# Altium schematic sheet Sheet1.SCHDOC
size 420 x 297 mm; SheetNumber: 1; SheetTotal: 1; DocumentName: Sheet1.SCHDOC
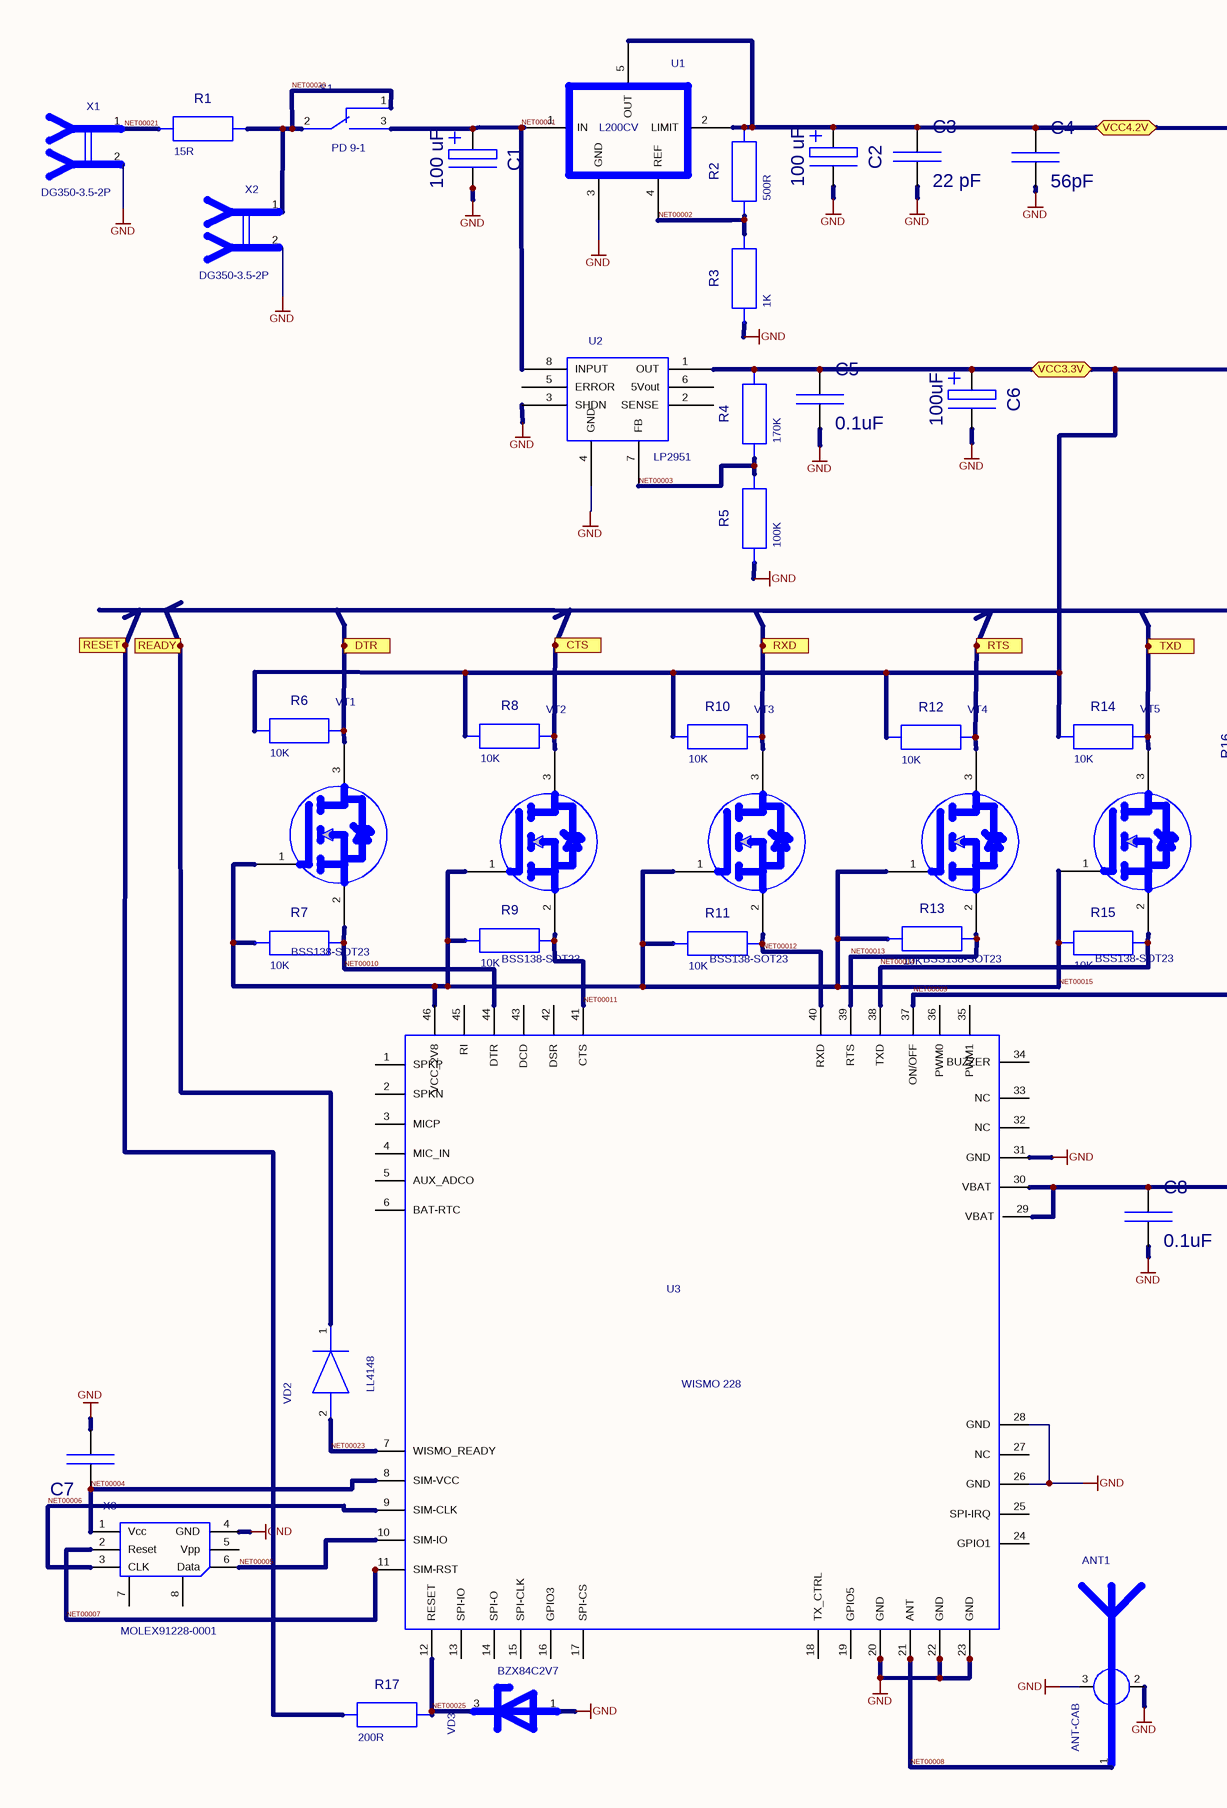
[diagram p0: Sheet1.SCHDOC, left]
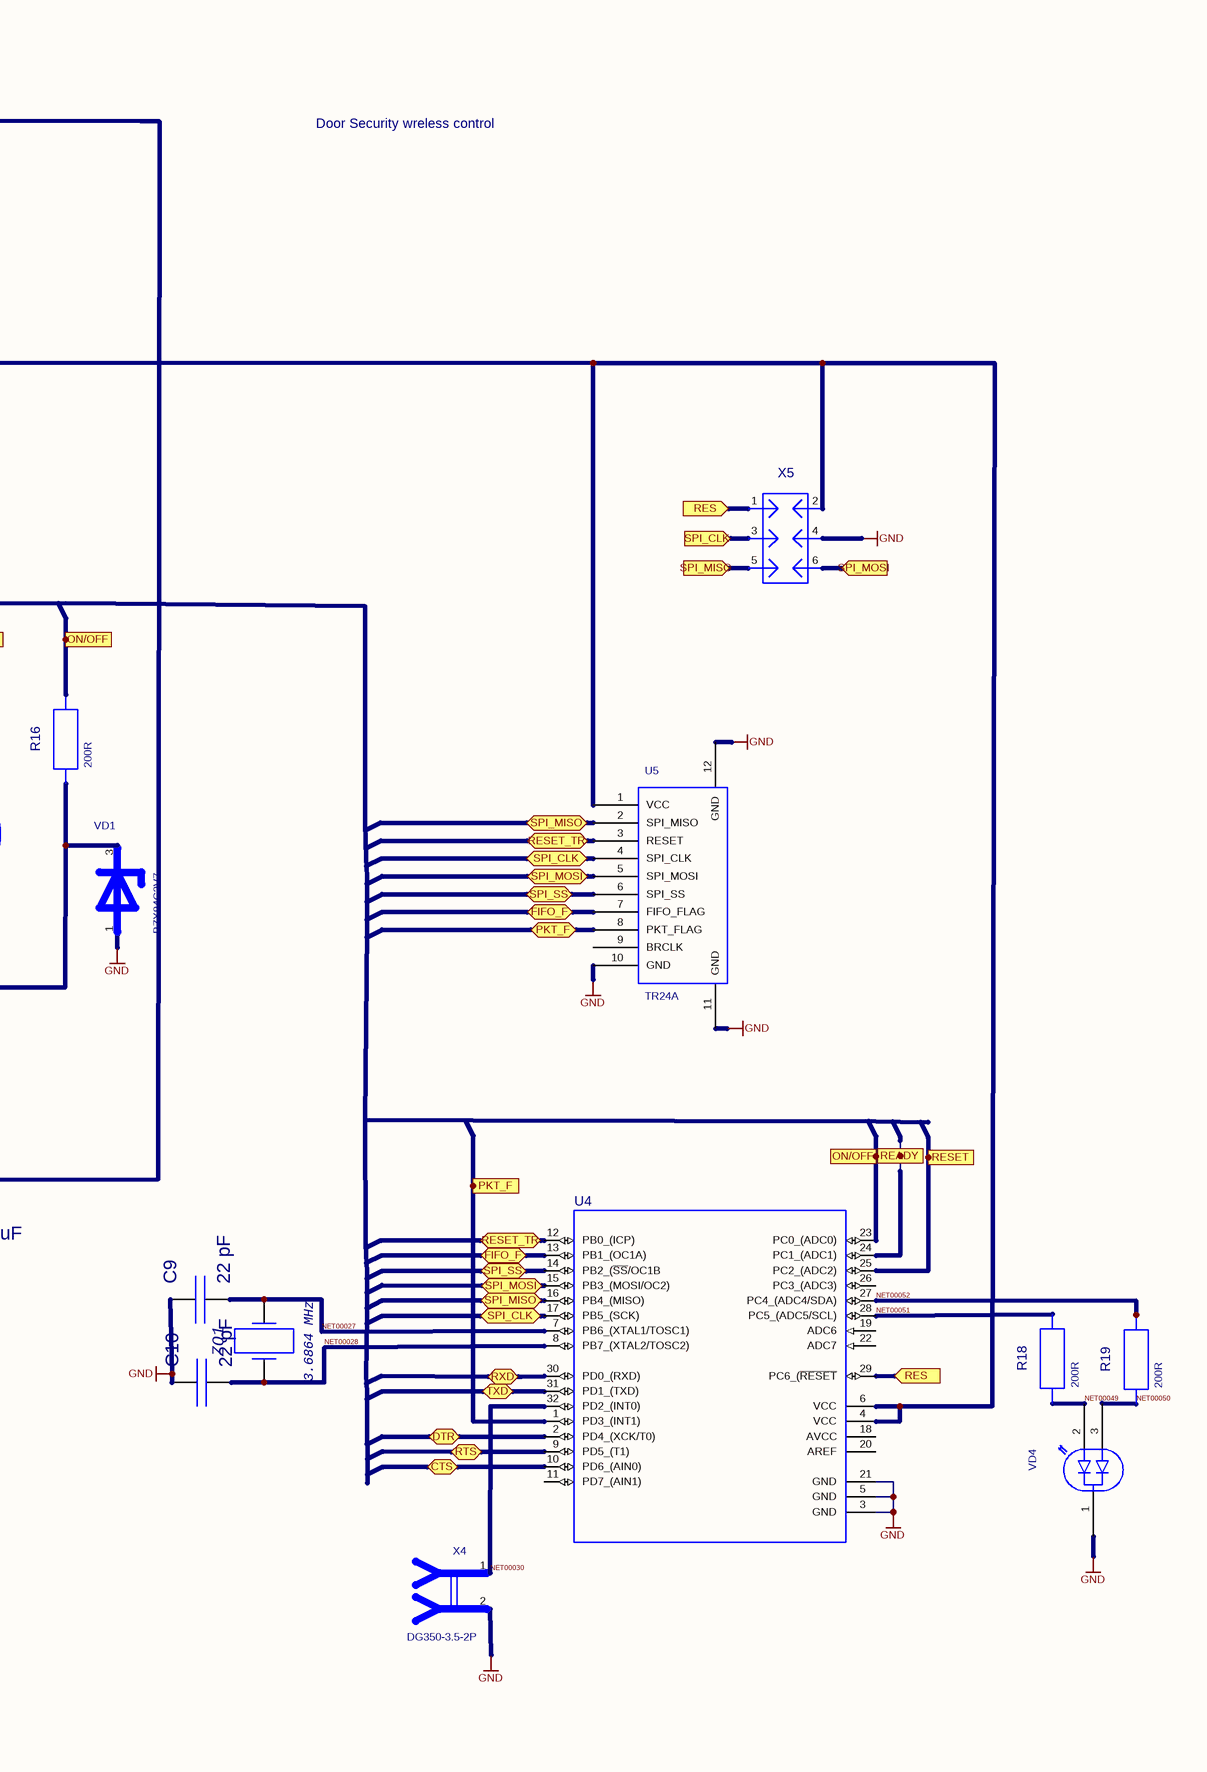
[diagram p1: Sheet1.SCHDOC, right]

## Parts
ANT1  ANT-CAB  [ANT-CAB_ANT-CAB()]
C1  value 100 uF  [KONDENS-E6.5_KONDENS-E6.5MM()]  (hidden comment: KONDENS-E6.5MM)
C2  value 100 uF  [KONDENS-E6.5_KONDENS-E6.5MM()]  (hidden comment: KONDENS-E6.5MM)
C3  value 22 pF  [C0805_KONDENS_SMD()]  (hidden comment: KONDENS_SMD)
C4  value 56pF  [C0805_KONDENS_SMD()]  (hidden comment: KONDENS_SMD)
C5  value 0.1uF  [C0805_KONDENS_SMD()]  (hidden comment: KONDENS_SMD)
C6  value 100uF  [KONDENS-E6.5_KONDENS-E6.5MM()]  (hidden comment: KONDENS-E6.5MM)
C7  KONDENS_SMD  [C0805_KONDENS_SMD()]  (value not drawn)
C8  value 0.1uF  [C0805_KONDENS_SMD()]  (hidden comment: KONDENS_SMD)
C9  value 22 pF  [C0805_KONDENS_SMD()]  (hidden comment: KONDENS_SMD)
C10  value 22 pF  [C0805_KONDENS_SMD()]  (hidden comment: KONDENS_SMD)
R1  value 15R  [R2W_R2W()]  (hidden comment: R2W)
R2  value 500R  [RR0805_RR0805()]  (hidden comment: RR0805)
R3  value 1K  [RR0805_RR0805()]  (hidden comment: RR0805)
R4  value 170K  [RR0805_RR0805()]  (hidden comment: RR0805)
R5  value 100K  [RR0805_RR0805()]  (hidden comment: RR0805)
R6  value 10K  [RR0805_RR0805()]  (hidden comment: RR0805)
R7  value 10K  [RR0805_RR0805()]  (hidden comment: RR0805)
R8  value 10K  [RR0805_RR0805()]  (hidden comment: RR0805)
R9  value 10K  [RR0805_RR0805()]  (hidden comment: RR0805)
R10  value 10K  [RR0805_RR0805()]  (hidden comment: RR0805)
R11  value 10K  [RR0805_RR0805()]  (hidden comment: RR0805)
R12  value 10K  [RR0805_RR0805()]  (hidden comment: RR0805)
R13  value 10K  [RR0805_RR0805()]  (hidden comment: RR0805)
R14  value 10K  [RR0805_RR0805()]  (hidden comment: RR0805)
R15  value 10K  [RR0805_RR0805()]  (hidden comment: RR0805)
R16  value 200R  [RR0805_RR0805()]  (hidden comment: RR0805)
R17  value 200R  [RR0805_RR0805()]  (hidden comment: RR0805)
R18  value 200R  [RR0805_RR0805()]  (hidden comment: RR0805)
R19  value 200R  [RR0805_RR0805()]  (hidden comment: RR0805)
S1  PD 9-1  [PD 9-1_PD 9-1()]
U1  L200CV  [L200CV_L200CV()]
U2  LP2951  [SOIC-8_LP2951()]
U3  WISMO 228  [WISMO_WISMO 228()]
U4  ATMEGA8L-8AI  [32A_ATMEGA8L-8AI()]  (value not drawn)
U5  TR24A  [TR24A_TR24A()]
VD1  BZX84C2V7  [SOT23_BZX84C2V7()]
VD2  LL4148  [MINI MELF_LL4148()]
VD3  BZX84C2V7  [SOT23_BZX84C2V7()]
VD4  LIGHTDIODE2  [LIGHTDIODE2_LIGHTDIODE2()]  (value not drawn)
VT1  BSS138-SOT23  [SOT23_BSS138-SOT23()]
VT2  BSS138-SOT23  [SOT23_BSS138-SOT23()]
VT3  BSS138-SOT23  [SOT23_BSS138-SOT23()]
VT4  BSS138-SOT23  [SOT23_BSS138-SOT23()]
VT5  BSS138-SOT23  [SOT23_BSS138-SOT23()]
X1  DG350-3.5-2P  [DG350-3.5-2P_DG350-3.5-2P()]
X2  DG350-3.5-2P  [DG350-3.5-2P_DG350-3.5-2P()]
X3  MOLEX91228-0001  [MOLEX91228-0001_MOLEX91228-0001()]
X4  DG350-3.5-2P  [DG350-3.5-2P_DG350-3.5-2P()]
X5  PLD2-06  [WW3-2_PLD2-06()]  (value not drawn)
ZQ1  value 3.6864 MHz  [HC-49/S-SMD_邢-99_(SMD)()]  (hidden comment: 邢-99_(SMD))

## Ports
CTS, CTS (bidir), DTR, DTR (bidir), FIFO_F (bidir), ON/OFF, PKT_F, PKT_F (bidir), READY, RES (in), RESET, RESET_TR (bidir), RTS, RTS (bidir), RXD, RXD (bidir), SPI_CLK (bidir), SPI_CLK (in), SPI_MISO (bidir), SPI_MISO (in), SPI_MOSI (bidir), SPI_MOSI (in), SPI_SS (bidir), TXD, TXD (bidir), VCC3.3V (bidir), VCC4.2V (bidir)

## Nets
GND: ANT1.3 U1.3(GND) U2.3(SHDN) U2.4(GND) U3.26(GND) U3.28(GND) U4.3(GND) U4.5(GND) U4.21(GND) X1.2 X2.2
CTS: R8.2(I/O1) U4.10(PD6_(AIN0)) VT2.3(Drain) ; port CTS
DTR: R6.2(I/O1) U4.2(PD4_(XCK/T0)) VT1.3(Drain) ; port DTR
FIFO_F: U4.13(PB1_(OC1A)) U5.7(FIFO_FLAG) ; port FIFO_F
NET00001: C1.1(PLUS) S1.3 U1.1(IN) U2.8(INPUT)
NET00002: R2.1(I/O0) R3.2(I/O1) U1.4(REF)
NET00003: R4.1(I/O0) R5.2(I/O1) U2.7(FB)
NET00004: C7.1(A) U3.8(SIM-VCC) X3.1(Vcc)
NET00005: U3.10(SIM-IO) X3.6(Data)
NET00006: U3.9(SIM-CLK) X3.3(CLK)
NET00007: U3.11(SIM-RST) X3.2(Reset)
NET00008: ANT1.1 U3.21(ANT)
NET00009: R16.1(I/O0) U3.37(ON/OFF) VD1.3
NET00010: R7.2(I/O1) U3.44(DTR) VT1.2(Source)
NET00011: R9.2(I/O1) U3.41(CTS) VT2.2(Source)
NET00012: R11.2(I/O1) U3.40(RXD) VT3.2(Source)
NET00013: R13.2(I/O1) U3.39(RTS) VT4.2(Source)
NET00014: R15.2(I/O1) U3.38(TXD) VT5.2(Source)
NET00015: R7.1(I/O0) R9.1(I/O0) R11.1(I/O0) R13.1(I/O0) R15.1(I/O0) U3.46(VCC_2V8) VT1.1(Gate) VT2.1(Gate) VT3.1(Gate) VT4.1(Gate) VT5.1(Gate)
NET00020: R1.2(I/OB) S1.1 S1.2 X2.1
NET00021: R1.1(I/OA) X1.1
NET00023: U3.7(WISMO_READY) VD2.2
NET00025: R17.2(I/O1) U3.12(RESET) VD3.3
NET00027: C9.2(B) U4.7(PB6_(XTAL1/TOSC1)) ZQ1.A
NET00028: C10.2(B) U4.8(PB7_(XTAL2/TOSC2)) ZQ1.B
NET00030: U4.32(PD2_(INT0)) X4.1
NET00049: R18.1(I/O0) VD4.2
NET00050: R19.1(I/O0) VD4.3
NET00051: R18.2(I/O1) U4.28(PC5_(ADC5/SCL))
NET00052: R19.2(I/O1) U4.27(PC4_(ADC4/SDA))
ON/OFF: R16.2(I/O1) U4.23(PC0_(ADC0)) ; port ON/OFF
PKT_F: U4.1(PD3_(INT1)) U5.8(PKT_FLAG) ; port PKT_F
READY: VD2.1 ; port READY
RES: U4.29(PC6_(~{RESET}) X5.1(I/O1) ; port RES
RESET: R17.1(I/O0) U4.25(PC2_(ADC2)) ; port RESET
RESET_TR: U4.12(PB0_(ICP)) U5.3(RESET) ; port RESET_TR
RTS: R12.2(I/O1) U4.9(PD5_(T1)) VT4.3(Drain) ; port RTS
RXD: R10.2(I/O1) U4.30(PD0_(RXD)) VT3.3(Drain) ; port RXD
SPI_CLK: U4.17(PB5_(SCK)) U5.4(SPI_CLK) X5.3(I/O3) ; port SPI_CLK
SPI_MISO: U4.16(PB4_(MISO)) U5.2(SPI_MISO) X5.5(I/O4) ; port SPI_MISO
SPI_MOSI: U4.15(PB3_(MOSI/OC2)) U5.5(SPI_MOSI) X5.6(I/O0) ; port SPI_MOSI
SPI_SS: U4.14(PB2_(~{SS}/OC1B) U5.6(SPI_SS) ; port SPI_SS
TXD: R14.2(I/O1) U4.31(PD1_(TXD)) VT5.3(Drain) ; port TXD
VCC3.3V: C5.1(A) C6.1(PLUS) R4.2(I/O1) R6.1(I/O0) R8.1(I/O0) R10.1(I/O0) R12.1(I/O0) R14.1(I/O0) U2.1(OUT) U4.4(VCC) U4.6(VCC) U5.1(VCC) X5.2(I/O5) ; port VCC3.3V
VCC4.2V: C2.1(PLUS) C3.1(A) C4.1(A) C8.1(A) R2.2(I/O1) U1.2(LIMIT) U1.5(OUT) U3.29(VBAT) U3.30(VBAT) ; port VCC4.2V
NetC9_1: C9.1(A) C10.1(A)
NetU3_20: U3.20(GND) U3.22(GND) U3.23(GND)

Not connected (* = marked no-connect by the designer): ANT1 2; C1 2(MINUS); C2 2(MINUS); C3 2(B); C4 2(B); C5 2(B); C6 2(MINUS); C7 2(B); C8 2(B); R3 1(I/O0); R5 1(I/O0); U2 2(SENSE) 5(ERROR) 6(5Vout); U3 1(SPKP) 2(SPKN) 3(MICP) 4(MIC_IN) 5(AUX_ADCO) 6(BAT-RTC) 13(SPI-IO) 14(SPI-O) 15(SPI-CLK) 16(GPIO3) 17(SPI-CS) 18(TX_CTRL) 19(GPIO5) 24(GPIO1) 25(SPI-IRQ) 27(NC) 31(GND) 32(NC) 33(NC) 34(BUZZER) 35(PWM1) 36(PWM0) 42(DSR) 43(DCD) 45(RI); U4 11(PD7_(AIN1)) 18(AVCC) 19(ADC6) 20(AREF) 22(ADC7) 24(PC1_(ADC1)) 26(PC3_(ADC3)); U5 9(BRCLK) 10(GND) 11(GND) 12(GND); VD1 1 2; VD3 1 2; VD4 1; X3 4(GND) 5(Vpp) 7(0) 8(1); X4 2; X5 4(I/O2)

## Notes on the sheet
- Door Security wreless control
- Labels drawn without touching a wire or pin: GND

## Library data of the parts
C7 = KONDENS_SMD: Value: 0.1uF
R1 = R2W: PDIF_TY: 11107
U4 = ATMEGA8L-8AI: PackageDocument: revB, Oct-2001; ComponentLink1DescBC: Manufacturer Link; ComponentLink2DescA4: Datasheet; Value: *; Published: 17-Sep-2003; LatestRevisionDate: 4-Mar-2005; LatestRevisionNote: Stylized 3D Model Added.; DatasheetDocument: 2486H-AVR-09/02; PackageReference: 32A; Publisher: Altium Limited; Code_JEDEC: MS-026-ABA; ComponentLink1URL: http://www.atmel.com; ComponentLink2URL: http://www.atmel.com/dyn/resources/prod_documents/doc2486.pdf
ZQ1 = 邢-99_(SMD): Description: Capacitor; Docum: 矣6321-004-0755883-99; Author: Sevastianov
ANT1 = ANT-CAB: Value: *
S1 = PD 9-1: Value: *
U1 = L200CV: Value: *
U2 = LP2951: Value: *
U3 = WISMO 228: Value: *
U5 = TR24A: Value: *
VD1 VD3 = BZX84C2V7: Value: *
VD2 = LL4148: Value: *
VD4 = LIGHTDIODE2: Value: *
VT1-VT5 = BSS138-SOT23: Value: *
X1 X2 X4 = DG350-3.5-2P: Value: *
X3 = MOLEX91228-0001: Value: *
X5 = PLD2-06: Value: *